# EAGLE schematic StickTen (EAGLE 5.10)
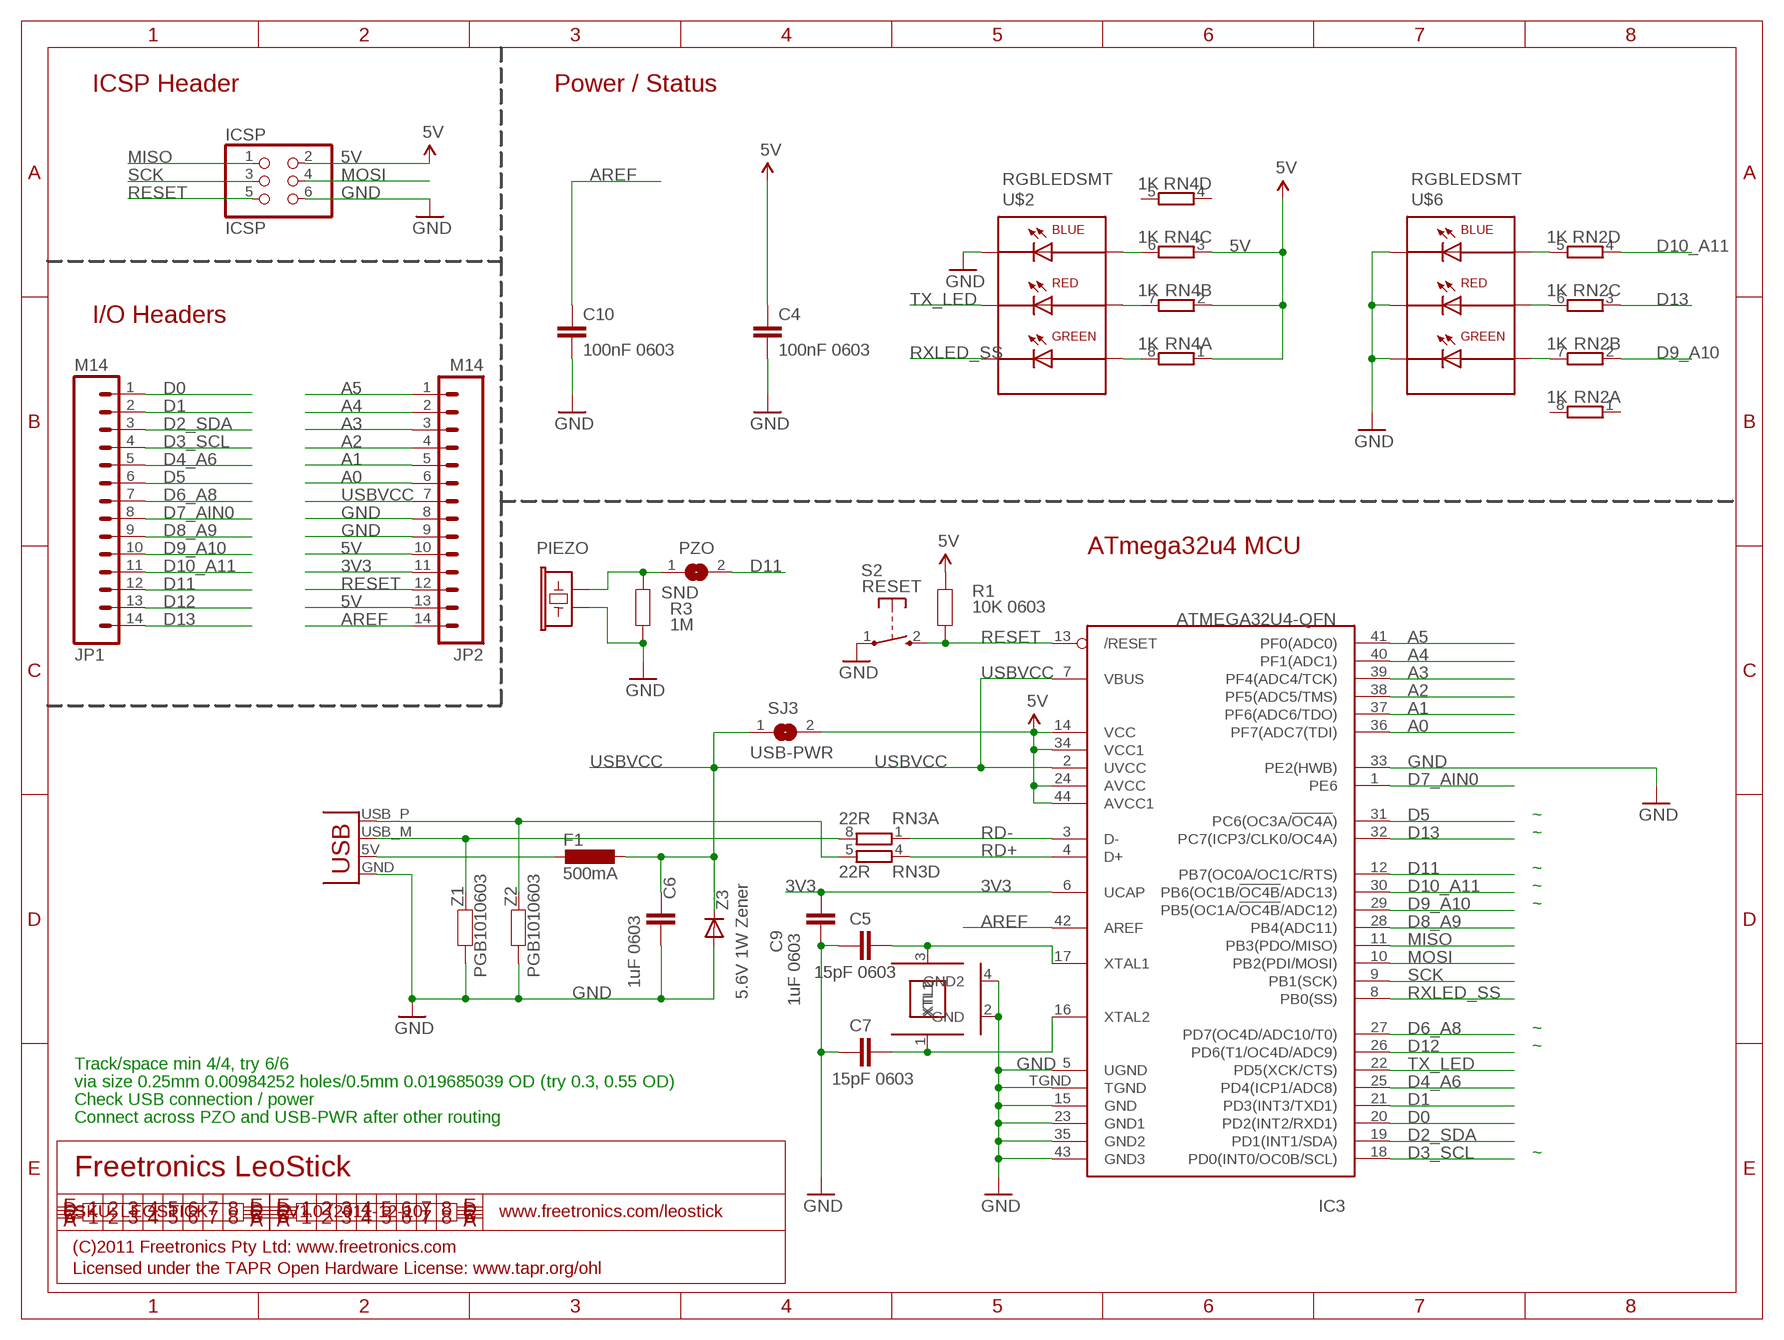
[diagram p0: schematic, sheet 1]

## Parts
C4  100nF 0603  CAP0603  [0603]
C5  15pF 0603  CAP0603  [0603]
C6  1uF 0603  CAP0603  [0603]
C7  15pF 0603  CAP0603  [0603]
C9  1uF 0603  CAP0603  [0603]
C10  100nF 0603  CAP0603  [0603]
F1  500mA  L-EUL1812  [L1812]
IC3  ATMEGA32U4-QFN  [QFN-44N]
ICSP  ICSP  PINHD-2X3  [2X03]
JP1  M14  [1X14]
JP2  M14  [1X14]
P1  USBPCB  [USB-A-PCB]
PIEZO  BUZZERSMD12X12  [BUZZER-12X12-SMT]
PZO  SND  SJ  [SJ]
R1  10K 0603  RESISTOR0603  [0603]
R3  1M  RESISTOR0603  [0603]
RN2  1K  4R-NCAY16  [CAY16]
RN3  22R  4R-NCAY16  [CAY16]
RN4  1K  4R-NCAY16  [CAY16]
S2  RESET  TAC_SWITCH_2PIN  [TACTILE_SWITCH_SMD_2PIN_TINY]
SJ3  USB-PWR  SJ  [SJ]
U$2  RGBLEDSMT  [19-337]
U$6  RGBLEDSMT  [19-337]
XTL1  CRYSTAL-GND3X2  [CRYSTAL-SMD-3X2]
Z1  PGB1010603  RESISTOR0603  [0603]
Z2  PGB1010603  RESISTOR0603  [0603]
Z3  5.6V 1W Zener  DIODESMA  [SMA-DIODE]

## Nets
3V3: C9.2 IC3.6(UCAP) JP2.11
5V: C4.1 IC3.14(VCC) IC3.24(AVCC) IC3.34(VCC1) IC3.44(AVCC1) ICSP.2 JP2.10 JP2.13 R1.2 RN4.1 RN4.2 RN4.3 SJ3.2
A0: IC3.36(PF7(ADC7(TDI)) JP2.6
A1: IC3.37(PF6(ADC6/TDO)) JP2.5
A2: IC3.38(PF5(ADC5/TMS)) JP2.4
A3: IC3.39(PF4(ADC4/TCK)) JP2.3
A4: IC3.40(PF1(ADC1)) JP2.2
A5: IC3.41(PF0(ADC0)) JP2.1
AREF: C10.1 IC3.42(AREF) JP2.14
BLUE: RN2.5 U$6.4(A-B)
D0: IC3.20(PD2(INT2/RXD1)) JP1.1
D1: IC3.21(PD3(INT3/TXD1)) JP1.2
D2_SDA: IC3.19(PD1(INT1/SDA)) JP1.3
D3_SCL: IC3.18(PD0(INT0/OC0B/SCL)) JP1.4
D4_A6: IC3.25(PD4(ICP1/ADC8)) JP1.5
D5: IC3.31(PC6(OC3A/!OC4A!)) JP1.6
D6_A8: IC3.27(PD7(OC4D/ADC10/T0)) JP1.7
D7_AIN0: IC3.1(PE6) JP1.8
D8_A9: IC3.28(PB4(ADC11)) JP1.9
D9_A10: IC3.29(PB5(OC1A/!OC4B!/ADC12)) JP1.10 RN2.2
D10_A11: IC3.30(PB6(OC1B/!OC4B!/ADC13)) JP1.11 RN2.4
D11: IC3.12(PB7(OC0A/OC1C/RTS)) JP1.12 PZO.2
D12: IC3.26(PD6(T1/OC4D/ADC9)) JP1.13
D13: IC3.32(PC7(ICP3/CLK0/OC4A)) JP1.14 RN2.3
D+: P1.USB_P(D+) RN3.5 Z2.2
D-: P1.USB_M(D-) RN3.8 Z1.2
GND: C4.2 C5.1 C6.2 C7.1 C9.1 C10.2 IC3.5(UGND) IC3.15(GND) IC3.23(GND1) IC3.33(PE2(HWB)) IC3.35(GND2) IC3.43(GND3) IC3.TGND ICSP.6 JP2.8 JP2.9 P1.GND PIEZO.1 R3.1 S2.1(P) U$2.1(C-B) U$6.1(C-B) U$6.2(C-R) U$6.3(C-G) XTL1.2(GND) XTL1.4(GND2) Z1.1 Z2.1 Z3.A
GREEN: RN2.7 U$6.6(A-G)
MISO: IC3.11(PB3(PDO/MISO)) ICSP.1
MOSI: IC3.10(PB2(PDI/MOSI)) ICSP.4
N$1: PIEZO.2 PZO.1 R3.2
N$2: F1.2 P1.5V(VBUS)
N$11: C5.2 IC3.17(XTAL1) XTL1.3(XTL2)
N$12: C7.2 IC3.16(XTAL2) XTL1.1(XTL1)
N$14: RN4.6 U$2.4(A-B)
N$16: RN4.7 U$2.5(A-R)
N$17: RN4.8 U$2.6(A-G)
RD+: IC3.4(D+) RN3.4
RD-: IC3.3(D-) RN3.1
RED: RN2.6 U$6.5(A-R)
RESET: IC3.13(/RESET) ICSP.5 JP2.12 R1.1 S2.2(S)
RXLED_SS: IC3.8(PB0(SS)) U$2.3(C-G)
SCK: IC3.9(PB1(SCK)) ICSP.3
TX_LED: IC3.22(PD5(XCK/CTS)) U$2.2(C-R)
USBVCC: C6.1 F1.1 IC3.2(UVCC) IC3.7(VBUS) JP2.7 SJ3.1 Z3.C
Unconnected: RN2.1 RN2.8 RN3.2 RN3.3 RN3.6 RN3.7 RN4.4 RN4.5

## Notes on the sheet
- ICSP Header | Power / Status
- I/O Headers
- ATmega32u4 MCU
- ~
- ~
- ~
- ~
- ~
- ~
- ~
- Track/space min 4/4, try 6/6
- via size 0.25mm 0.00984252 holes/0.5mm 0.019685039 OD (try 0.3, 0.55 OD)
- Check USB connection / power
- Connect across PZO and USB-PWR after other routing
- ~
- Freetronics LeoStick
- SKU: LEOSTICK | V1.0 (2011-12-10) | www.freetronics.com/leostick
- (C)2011 Freetronics Pty Ltd: www.freetronics.com
- Licensed under the TAPR Open Hardware License: www.tapr.org/ohl

## Library data of the parts
C4-C7 C9 C10 = freetronics-master-v1.1:CAP: Capacitor Standard 0603 ceramic capacitor, and 0.1" leaded capacitor.
F1 = rcl:L-EU: INDUCTOR, European symbol
IC3 = freetronics-jon:ATMEGA32U4: ATMEGA32U4
ICSP = pinhead:PINHD-2X3: PIN HEADER
JP1 JP2 = freetronics-jon:M14: Header 14 Standard 14-pin 0.1" header. Use with straight break away headers (SKU : PRT-00116), right angle break away headers (PRT-00553), swiss pins (PRT-00743), machine pins (PRT-00117), and female headers (PRT-00115).
P1 = freetronics-master-v1:USB: USB Connectors USB-B-PTH is fully proven SKU : PRT-00139 USB-miniB is fully proven SKU : PRT-00587 USB-A-PCB is untested. USB-A-H is throughly reviewed, but untested. Spark Fun Electronics SKU : PRT-00437 USB-B-SMT is throughly reviewed, but untested. Needs silkscreen touching up. USB-A-S has not been used/tested USB-MB-H has not been used/tested
PIEZO = freetronics-master-v1:BUZZER: Buzzer - Piezo Transducer
PZO SJ3 = jumper:SJ: SMD solder JUMPER
R1 Z1 Z2 = freetronics-master-v1.1:RESISTOR: Resistor Basic schematic elements and footprints for 0603, 1206, and PTH 1/10th watt (small) resistors.
R3 = freetronics-master-v1:RESISTOR: Resistor Basic schematic elements and footprints for 0603, 1206, and PTH 1/10th watt (small) resistors.
RN2-RN4 = resistor-dil:4R-N: Array Chip Resistor Source: RS Component / Phycomp
S2 = freetronics-master-v1:TAC_SWITCH_2PIN: Momentary Tactile Switch - 2 pin
U$2 U$6 = freetronics-jon:RGBLED
XTL1 = freetronics-jon:CRYSTAL-GND
Z3 = freetronics-master-v1:DIODE: Diode These are standard reverse protection diodes and small signal diodes. SMA package can handle up to about 1A. SOD-323 can handle about 200mA. What the SOD-323 package when ordering, there are some mfgs out there that are 5-pin packages.

## Net classes
0 default: width 0.152 mm, drill 0.241 mm, clearance 0.152 mm